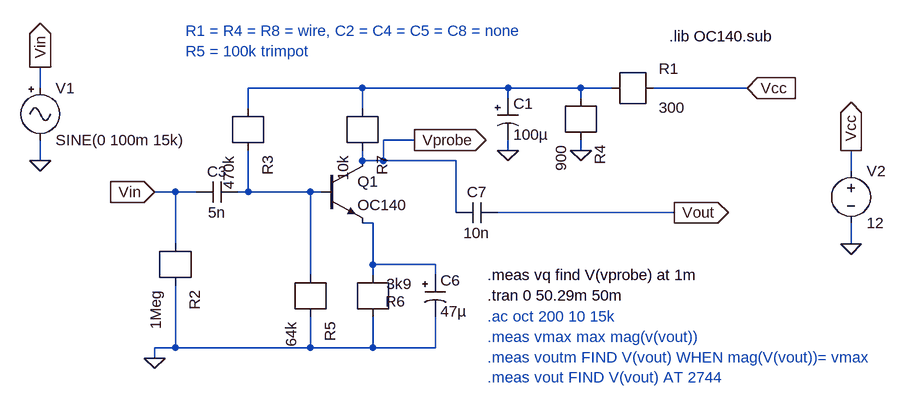
[diagram p0: schematic germanium12.asc]
germanium12.asc, the LTspice schematic file:
Version 4
SHEET 1 1208 680
WIRE -288 64 -288 32
WIRE 208 64 32 64
WIRE 432 64 208 64
WIRE 544 64 432 64
WIRE 592 64 544 64
WIRE 800 64 656 64
WIRE 432 80 432 64
WIRE 544 80 544 64
WIRE 32 96 32 64
WIRE 208 96 208 64
WIRE 288 144 240 144
WIRE 432 160 432 144
WIRE 544 160 544 144
WIRE -288 176 -288 144
WIRE 208 176 208 160
WIRE 240 176 240 144
WIRE 240 176 208 176
WIRE 352 176 240 176
WIRE 960 192 960 160
WIRE -80 224 -112 224
WIRE -48 224 -80 224
WIRE 32 224 32 160
WIRE 32 224 16 224
WIRE 128 224 32 224
WIRE 144 224 128 224
WIRE 352 256 352 176
WIRE 688 256 416 256
WIRE 224 272 208 272
WIRE -80 304 -80 224
WIRE 960 304 960 272
WIRE 224 336 224 272
WIRE 320 336 224 336
WIRE 128 352 128 224
WIRE 224 352 224 336
WIRE 320 352 320 336
WIRE -80 464 -80 368
WIRE -80 464 -112 464
WIRE 128 464 128 416
WIRE 128 464 -80 464
WIRE 224 464 224 416
WIRE 224 464 128 464
WIRE 320 464 320 416
WIRE 320 464 224 464
WIRE -112 480 -112 464
FLAG -112 224 Vin
IOPIN -112 224 In
FLAG -112 480 0
FLAG 432 160 0
FLAG 800 64 Vcc
IOPIN 800 64 In
FLAG 688 256 Vout
IOPIN 688 256 Out
FLAG -288 32 Vin
IOPIN -288 32 Out
FLAG -288 176 0
FLAG 960 304 0
FLAG 960 160 Vcc
IOPIN 960 160 Out
FLAG 288 144 Vprobe
IOPIN 288 144 Out
FLAG 544 160 0
SYMBOL npn 144 176 R0
SYMATTR InstName Q1
SYMATTR Value OC140
SYMBOL r 32 96 R90
SYMATTR InstName R3
SYMATTR Value 470k
SYMBOL r 128 352 R90
SYMATTR InstName R5
SYMATTR Value 64k
SYMBOL r 224 352 R90
WINDOW 0 41 -50 VRight 2
WINDOW 3 14 -60 VRight 2
SYMATTR InstName R6
SYMATTR Value 3k9
SYMBOL r 208 96 R90
SYMATTR InstName R7
SYMATTR Value 10k
SYMBOL cap 16 208 R90
WINDOW 0 0 32 VBottom 2
WINDOW 3 32 32 VTop 2
SYMATTR InstName C3
SYMATTR Value 5n
SYMBOL cap 416 240 R90
WINDOW 0 0 32 VBottom 2
WINDOW 3 32 32 VTop 2
SYMATTR InstName C7
SYMATTR Value 10n
SYMBOL polcap 304 352 R0
SYMATTR InstName C6
SYMATTR Value 47µ
SYMBOL polcap 416 80 R0
SYMATTR InstName C1
SYMATTR Value 100µ
SYMBOL signal -288 48 R0
SYMATTR InstName V1
SYMATTR Value SINE(0 100m 15k)
SYMATTR Value2 AC 100m
SYMBOL voltage 960 176 R0
SYMATTR InstName V2
SYMATTR Value 12
SYMBOL r -80 304 R90
SYMATTR InstName R2
SYMATTR Value 1Meg
SYMBOL r 592 64 R0
SYMATTR InstName R1
SYMATTR Value 300
SYMBOL r 544 80 R90
SYMATTR InstName R4
SYMATTR Value 900
TEXT 400 352 Left 2 !.meas vq find V(vprobe) at 1m\n.tran 0 50.29m 50m
TEXT -64 -24 Left 2 ;R1 = R4 = R8 = wire, C2 = C4 = C5 = C8 = none\nR5 = 100k trimpot
TEXT 680 -16 Left 2 !.lib OC140.sub
TEXT 400 416 Left 2 ;.ac oct 200 10 15k\n.meas vmax max mag(v(vout))\n.meas voutm FIND V(vout) WHEN mag(V(vout))= vmax\n.meas vout FIND V(vout) AT 2744

The netlist it stands for:
* germanium12.asc
Q1 Vprobe N002 N003 0 OC140
R3 N002 N001 470k
R5 0 N002 64k
R6 0 N003 3k9
R7 Vprobe N001 10k
C3 N002 Vin 5n
C7 Vout Vprobe 10n
C6 N003 0 47µ
C1 N001 0 100µ
V1 Vin 0 SINE(0 100m 15k) AC 100m
V2 Vcc 0 12
R2 0 Vin 1Meg
R1 Vcc N001 300
R4 0 N001 900
.model NPN NPN
.model PNP PNP
.lib standard.bjt
.meas vq find V(vprobe) at 1m
.tran 0 50.29m 50m
* R1 = R4 = R8 = wire, C2 = C4 = C5 = C8 = none
* R5 = 100k trimpot
.lib OC140.sub
* .ac oct 200 10 15k
* .meas vmax max mag(v(vout))
* .meas voutm FIND V(vout) WHEN mag(V(vout))= vmax
* .meas vout FIND V(vout) AT 2744
.backanno
.end